# EAGLE design Group G (EAGLE 9.6.2)
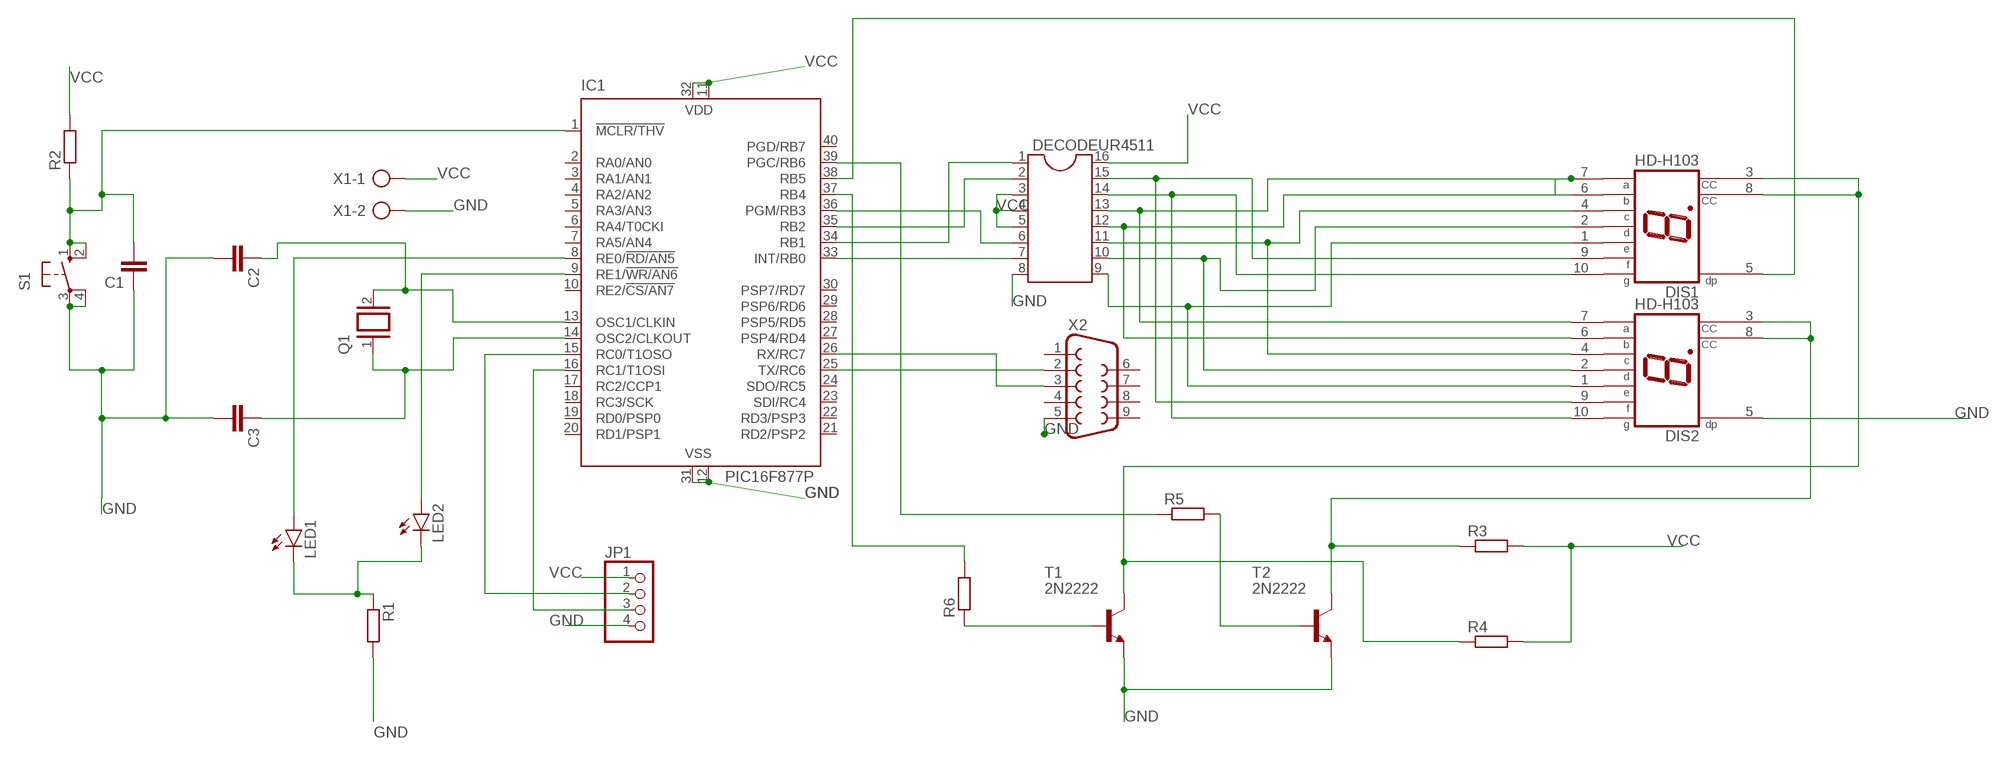
[diagram p0: schematic, sheet 1]

## Parts
C1  C-EU025-025X050  [C025-025X050]
C2  C-EU025-025X050  [C025-025X050]
C3  C-EU025-025X050  [C025-025X050]
DECODEUR4511  DIL16  [DIL16]
DIS1  HD-H103  [HDSP-M]
DIS2  HD-H103  [HDSP-M]
IC1  PIC16F877P  [DIL40]
JP1  PINHD-1X4  [1X04]
LED1  LED5MM  [LED5MM]
LED2  LED5MM  [LED5MM]
Q1  XTAL/S  [QS]
R1  R-EU_0207/10  [0207/10]
R2  R-EU_0207/10  [0207/10]
R3  R-EU_0207/10  [0207/10]
R4  R-EU_0207/10  [0207/10]
R5  R-EU_0207/10  [0207/10]
R6  R-EU_0207/10  [0207/10]
S1  10-XX  [B3F-10XX]
T1  2N2222  [TO18]
T2  2N2222  [TO18]
X1  AK300/2  [AK300/2]
X2  F09H  [F09H]

## Nets
GND: C1.1 C2.2 C3.2 DECODEUR4511.8 DIS2.5(DP) IC1.12(VSS) IC1.31(VSS) JP1.4 R1.2 S1.3(P) S1.4(P1) T1.1(E) T2.1(E) X1.2 X2.5
N$1: IC1.25(TX/RC6) X2.2
N$2: IC1.26(RX/RC7) X2.3
N$3: DECODEUR4511.7 IC1.33(INT/RB0)
N$4: DECODEUR4511.1 IC1.34(RB1)
N$5: DECODEUR4511.2 IC1.35(RB2)
N$6: DECODEUR4511.6 IC1.36(PGM/RB3)
N$7: DECODEUR4511.13 DIS1.7(A) DIS2.7(A)
N$8: DECODEUR4511.15 DIS1.9(F) DIS2.9(F)
N$9: DECODEUR4511.14 DIS1.10(G) DIS2.10(G)
N$10: DECODEUR4511.10 DIS1.2(D) DIS2.2(D)
N$11: DECODEUR4511.12 DIS1.6(B) DIS2.6(B)
N$12: DECODEUR4511.11 DIS1.4(C) DIS2.4(C)
N$13: DECODEUR4511.9 DIS1.1(E) DIS2.1(E)
N$14: IC1.8(RE0/!RD/AN5) LED1.A
N$15: IC1.37(RB4) R6.2
N$16: R6.1 T1.2(B)
N$17: IC1.15(RC0/T1OSO) JP1.2
N$18: DIS1.5(DP) IC1.38(RB5)
N$19: IC1.39(PGC/RB6) R5.1
N$20: R5.2 T2.2(B)
N$23: IC1.9(RE1/!WR/AN6) LED2.A
N$26: C1.2 IC1.1(!MCLR/THV) R2.1 S1.1(S) S1.2(S1)
N$27: IC1.16(RC1/T1OSI) JP1.3
N$30: C2.1 IC1.13(OSC1/CLKIN) Q1.2
N$31: C3.1 IC1.14(OSC2/CLKOUT) Q1.1
N$32: DIS1.3(CC) DIS1.8(CC) R4.1 T1.3(C)
N$35: DIS2.3(CC) DIS2.8(CC) R3.1 T2.3(C)
N$36: LED1.K(C) LED2.K(C) R1.1
VCC: DECODEUR4511.3 DECODEUR4511.4 DECODEUR4511.5 DECODEUR4511.16 IC1.11(VDD) IC1.32(VDD) JP1.1 R2.2 R3.2 R4.2 X1.1
Unconnected: IC1.2(RA0/AN0) IC1.3(RA1/AN1) IC1.4(RA2/AN2) IC1.5(RA3/AN3) IC1.6(RA4/T0CKI) IC1.7(RA5/AN4) IC1.10(RE2/!CS/AN7) IC1.17(RC2/CCP1) IC1.18(RC3/SCK) IC1.19(RD0/PSP0) IC1.20(RD1/PSP1) IC1.21(RD2/PSP2) IC1.22(RD3/PSP3) IC1.23(SDI/RC4) IC1.24(SDO/RC5) IC1.27(PSP4/RD4) IC1.28(PSP5/RD5) IC1.29(PSP6/RD6) IC1.30(PSP7/RD7) IC1.40(PGD/RB7) X2.1 X2.4 X2.6 X2.7 X2.8 X2.9

## Library data of the parts
C1-C3 = rcl:C-EU: CAPACITOR, European symbol; SPICEPREFIX: C
DECODEUR4511 = ic-package:DIL16: Dual In Line / Socket
DIS1 DIS2 = display-hp:HD-H103: LED DISPLAY 1-character 7 segment, decimal point right; OC_FARNELL: unknown; OC_NEWARK: unknown
IC1 = microchip:PIC16F87*: MICROCONTROLLER; MF: MICROCHIP; MPN: PIC16F877-04/P; OC_FARNELL: 9761349; OC_NEWARK: 61K3463
JP1 = pinhead:PINHD-1X4: PIN HEADER
LED1 LED2 = led:LED: LED OSRAM: - CHIPLED LG R971, LG N971, LY N971, LG Q971, LY Q971, LO R971, LY R971 LH N974, LH R974 LS Q976, LO Q976, LY Q976 LO Q996 - Hyper CHIPLED LW Q18S LB Q993, LB Q99A, LB R99A - SideLED LS A670, LO A670, LY A670, LG A670, LP A670 LB A673, LV A673, LT A673, LW A673 LH A674 LY A675 LS A676, LA A676, LO A676, LY A676, LW A676 LS A679, LY A679, LG A679 - Hyper Micro SIDELED® LS Y876, LA Y876, LO Y876, LY Y876 LT Y87S - SmartLED LW L88C, LW L88S LB L89C, LB L89S, LG L890 LS L89K, LO L89K, LY L89K LS L896, LA L896, LO L896, LY L896 - TOPLED LS T670, LO T670, LY T670, LG T670, LP T670 LSG T670, LSP T670, LSY T670, LOP T670, LYG T670 LG T671, LOG T671, LSG T671 LB T673, LV T673, LT T673, LW T673 LH T674 LS T676, LA T676, LO T676, LY T676, LB T676, LH T676, LSB T676, LW T676 LB T67C, LV T67C, LT T67C, LS T67K, LO T67K, LY T67K, LW E67C LS E67B, LA E67B, LO E67B, LY E67B, LB E67C, LV E67C, LT E67C LW T67C LS T679, LY T679, LG T679 LS T770, LO T770, LY T770, LG T770, LP T770 LB T773, LV T773, LT T773, LW T773 LH T774 LS E675, LA E675, LY E675, LS T675 LS T776, LA T776, LO T776, LY T776, LB T776 LHGB T686 LT T68C, LB T68C - Hyper Mini TOPLED® LB M676 - Mini TOPLED Santana® LG M470 LS M47K, LO M47K, LY M47K Source: http://www.osram.convergy.de LUXEON: - LUMILED® LXK2-PW12-R00, LXK2-PW12-S00, LXK2-PW14-U00, LXK2-PW14-V00 LXK2-PM12-R00, LXK2-PM12-S00, LXK2-PM14-U00 LXK2-PE12-Q00, LXK2-PE12-R00, LXK2-PE12-S00, LXK2-PE14-T00, LXK2-PE14-U00 LXK2-PB12-K00, LXK2-PB12-L00, LXK2-PB12-M00, LXK2-PB14-N00, LXK2-PB14-P00, LXK2-PB14-Q00 LXK2-PR12-L00, LXK2-PR12-M00, LXK2-PR14-Q00, LXK2-PR14-R00 LXK2-PD12-Q00, LXK2-PD12-R00, LXK2-PD12-S00 LXK2-PH12-R00, LXK2-PH12-S00 LXK2-PL12-P00, LXK2-PL12-Q00, LXK2-PL12-R00 Source: www.luxeon.com KINGBRIGHT: KA-3528ASYC Source: www.kingbright.com
Q1 = special:XTAL/S: CRYSTAL
R1-R6 = rcl:R-EU_: RESISTOR, European symbol; SPICEPREFIX: R
S1 = switch-omron:10-XX: OMRON SWITCH; MPN: B3F-1000; OC_FARNELL: 176432; OC_NEWARK: 36M3542
T1 T2 = transistor-neu-to92:2N2222: NPN TRANSISTOR
X1 = con-ptr500:AK300/2: CONNECTOR; OC_FARNELL: unknown; OC_NEWARK: unknown
X2 = con-subd:F09: SUB-D; OC_FARNELL: unknown; OC_NEWARK: unknown

## Board
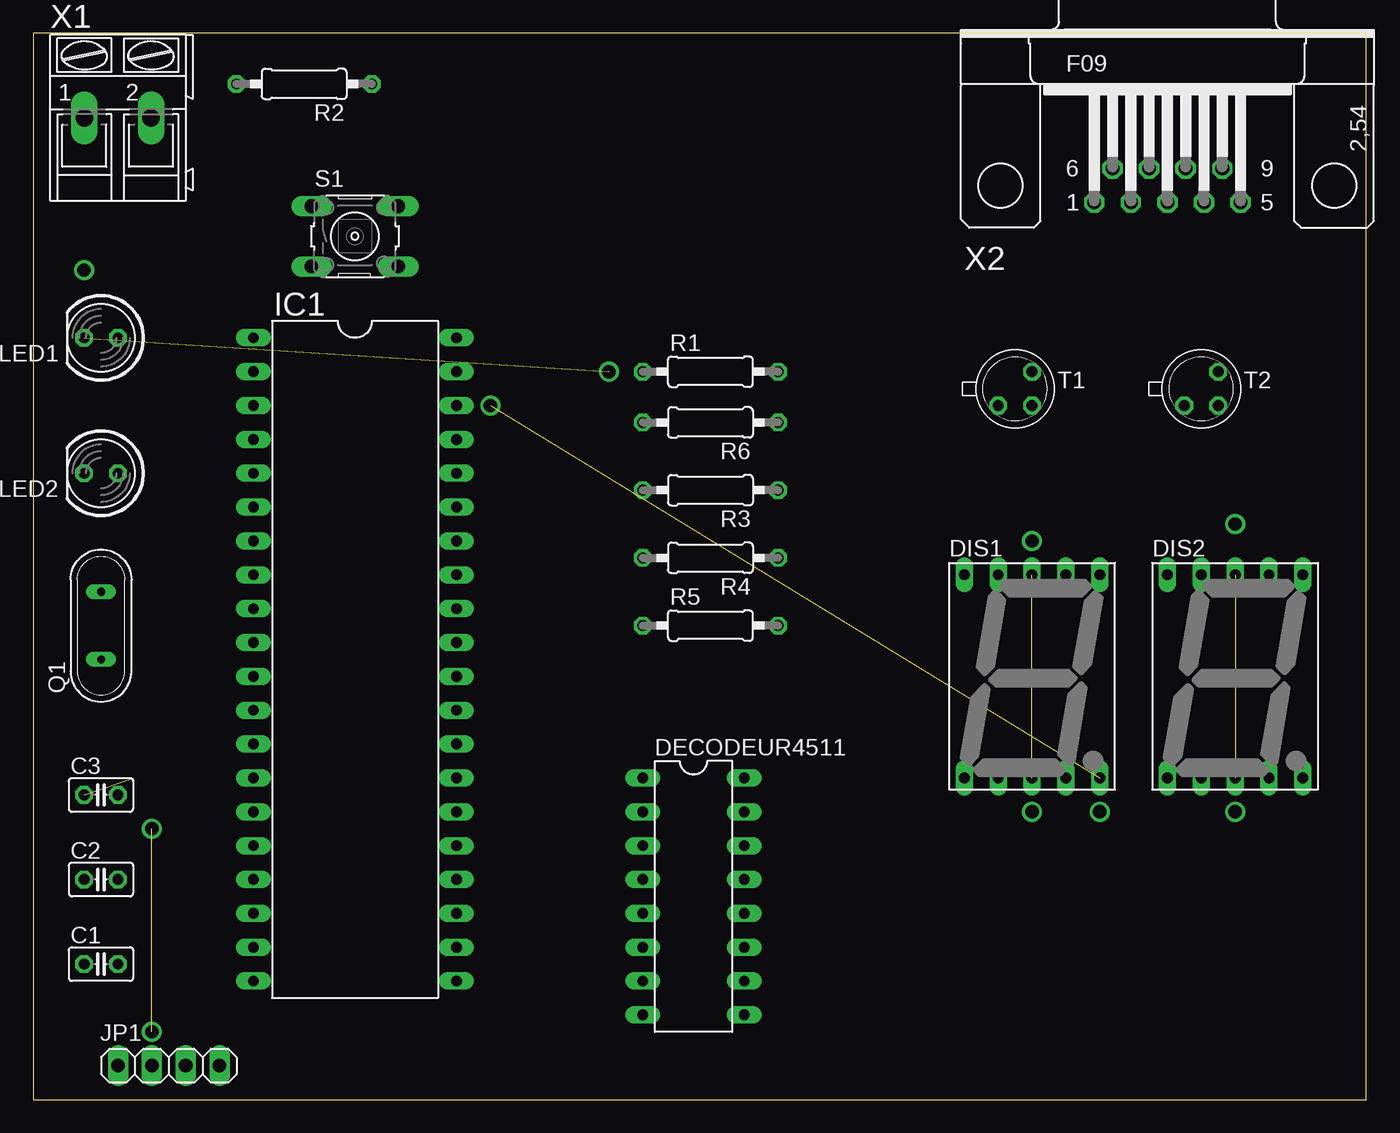
[diagram p1: board, top side]
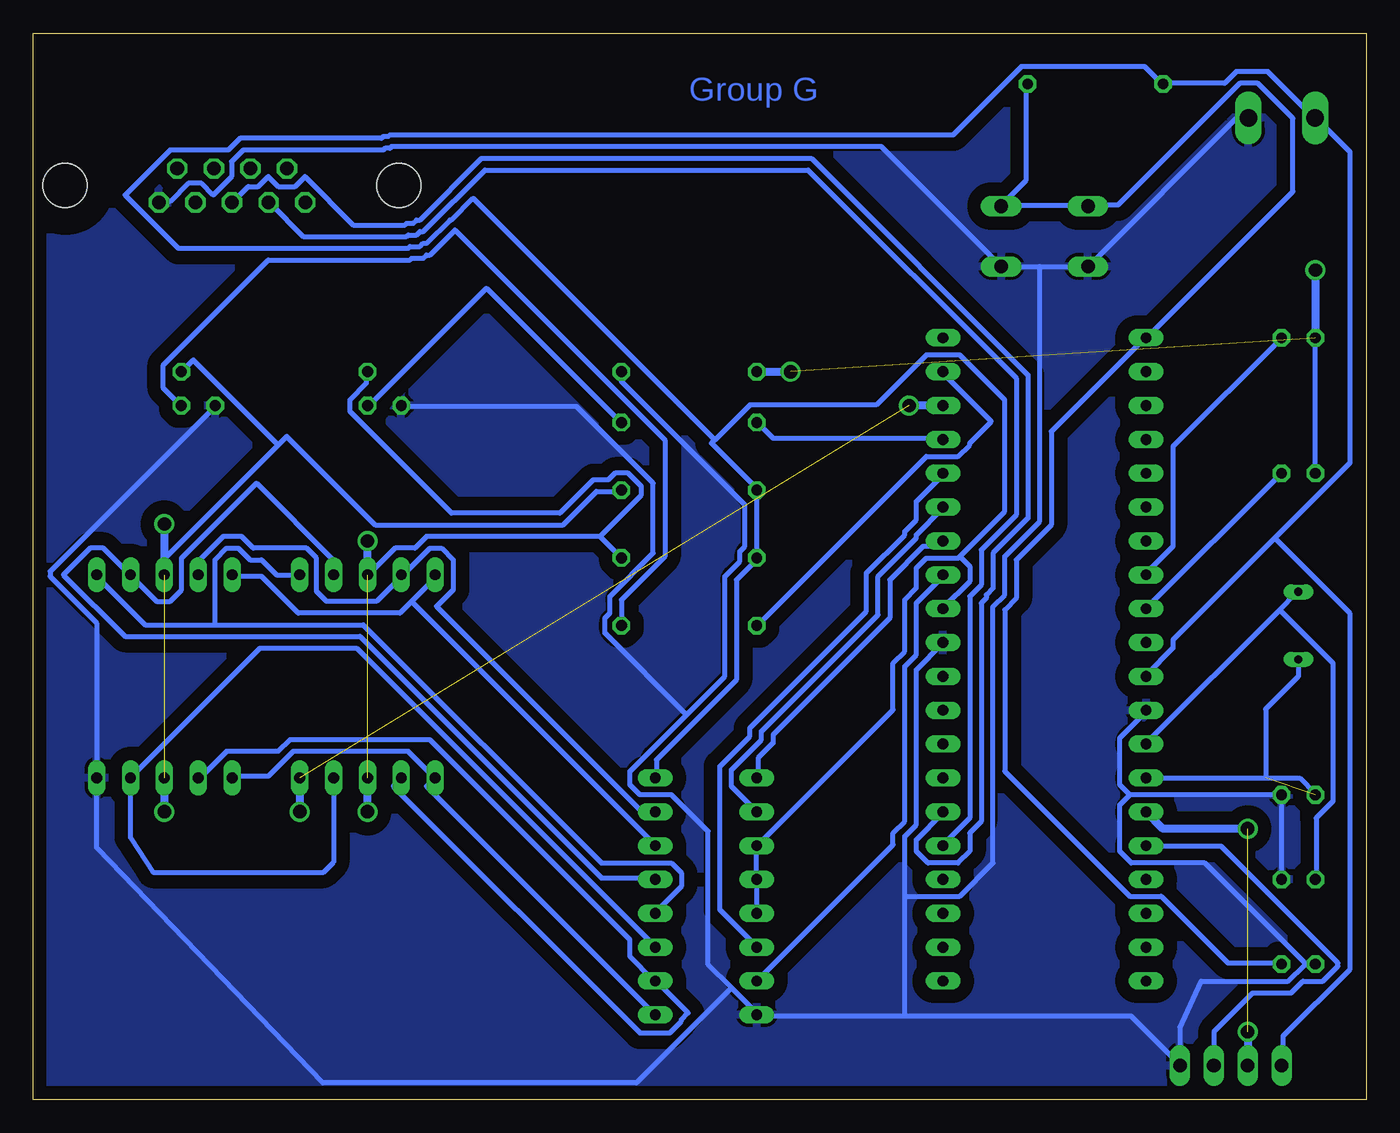
[diagram p2: board, bottom side, seen from below]

Size 100 x 80 mm. Coordinates in mm from the lower left corner, seen from the top.
Outline: 0,0 100,0 100,80 0,80 0,0
Copper layers (1*16): Top 0.035mm / dielectric 1.5mm / Bottom 0.035mm
Design rules "default *": minimum track width 15mil, minimum drill 0.35mm, track to track 15mil, track to pad 15mil, pad to pad 15mil, via to via 15mil, smd to smd 15mil, copper to edge 40mil, drill to drill 6mil, minimum pad ring 10mil, minimum via ring 8mil, stop-mask expansion 4mil, vias tented up to drill 0mil, thermal gap 10mil

### Footprints (pad centres in the part's own frame; a part is rotated, then mirrored left to right if it is on the bottom)
C025-025X050 = drill 0.813 octagon: 1 -1.27,0; 2 1.27,0
DIL16 = drill 0.813 long: 1 -8.89,-3.81; 2 -6.35,-3.81; 3 -3.81,-3.81; 4 -1.27,-3.81; 5 1.27,-3.81; 6 3.81,-3.81; 7 6.35,-3.81; 8 8.89,-3.81; 9 8.89,3.81; 10 6.35,3.81; 11 3.81,3.81; 12 1.27,3.81; 13 -1.27,3.81; 14 -3.81,3.81; 15 -6.35,3.81; 16 -8.89,3.81
HDSP-M = drill 0.813 long: 1 -5.08,-7.62; 2 -2.54,-7.62; 3 0,-7.62; 4 2.54,-7.62; 5 5.08,-7.62; 6 5.08,7.62; 7 2.54,7.62; 8 0,7.62; 9 -2.54,7.62; 10 -5.08,7.62
DIL40 = drill 0.813 long: 1 -24.13,-7.62; 2 -21.59,-7.62; 3 -19.05,-7.62; 4 -16.51,-7.62; 5 -13.97,-7.62; 6 -11.43,-7.62; 7 -8.89,-7.62; 8 -6.35,-7.62; 9 -3.81,-7.62; 10 -1.27,-7.62; 11 1.27,-7.62; 12 3.81,-7.62; 13 6.35,-7.62; 14 8.89,-7.62; 15 11.43,-7.62; 16 13.97,-7.62; 17 16.51,-7.62; 18 19.05,-7.62; 19 21.59,-7.62; 20 24.13,-7.62; 21 24.13,7.62; 22 21.59,7.62; 23 19.05,7.62; 24 16.51,7.62; 25 13.97,7.62; 26 11.43,7.62; 27 8.89,7.62; 28 6.35,7.62; 29 3.81,7.62; 30 1.27,7.62; 31 -1.27,7.62; 32 -3.81,7.62; 33 -6.35,7.62; 34 -8.89,7.62; 35 -11.43,7.62; 36 -13.97,7.62; 37 -16.51,7.62; 38 -19.05,7.62; 39 -21.59,7.62; 40 -24.13,7.62
1X04 = drill 1.016 long: 1 -3.81,0; 2 -1.27,0; 3 1.27,0; 4 3.81,0
LED5MM = drill 0.813 octagon: A -1.27,0; K 1.27,0
QS = drill 0.61 long: 1 -2.54,0; 2 2.54,0
0207/10 = drill 0.813 octagon: 1 -5.08,0; 2 5.08,0
B3F-10XX = drill 1.016 long: 1 -3.251,2.261; 2 3.251,2.261; 3 -3.251,-2.261; 4 3.251,-2.261
TO18 = drill 0.813 octagon: 1 -1.27,-1.27; 2 1.27,-1.27; 3 1.27,1.27
AK300/2 = drill 1.321 long: 1 -2.515,0; 2 2.489,0
F09H = drill 1.016 octagon: 1 -5.486,-1.27; 2 -2.743,-1.27; 3 0,-1.27; 4 2.743,-1.27; 5 5.486,-1.27; 6 -4.115,1.27; 7 -1.372,1.27; 8 1.372,1.27; 9 4.115,1.27 | hole 3.302: -12.522,0; 12.522,0

### Placement (x,y rotation side)
C1  5.08,10.16 0 top
C2  5.08,16.51 0 top
C3  5.08,22.86 0 top
DECODEUR4511  49.53,15.24 270 top
DIS1  74.93,31.75 0 top
DIS2  90.17,31.75 0 top
IC1  24.13,33.02 270 top
JP1  10.16,2.54 0 top
LED1  5.08,57.15 180 top
LED2  5.08,46.99 180 top
Q1  5.08,35.56 90 top
R1  50.8,54.61 0 top
R2  20.32,76.2 180 top
R3  50.8,45.72 180 top
R4  50.8,40.64 180 top
R5  50.8,35.56 0 top
R6  50.8,50.8 180 top
S1  24.13,64.77 0 top
T1  73.66,53.34 0 top
T2  87.63,53.34 0 top
X1  6.35,73.66 0 top
X2  85.09,68.58 0 top

### Tracks (layer width: path | path; a pad name or v marks a point on that pad's centre or on a via)
GND
  Bottom 0.381: 24.5,62.5 S1.4 27.5,62.62 36.38,71.5 73.12,71.5 73.25,71.38 73.62,71.38 73.75,71.25 84.25,71.25 85.12,70.38 85.12,69.25 86.5,67.88 87.38,68.75 88.38,68.75 89.75,67.38 90.5,67.38 X2.5 | 24.5,62.5 21,62.5 S1.3 20.75,62.62 9.75,73.62 8.88,73.62 X1.2 | T2.1 86.38,52 98.75,39.62 98.75,39.25 95.25,35.75 DIS2.5 95.25,18.9 78.28,1.25 54.75,1.25 47.62,8.38 | C2.2 6.38,16.62 6.38,22.75 C3.2 6.5,22.88 17.75,22.88 | 17.75,22.88 18.5,23.62 18.5,27.12 16.62,29 16.62,29.12 IC1.12 | 34.62,6.25 17.62,6.25 14,2.62 JP1.4 13.97,5.35 12.37,8.88 5.88,8.88 4.62,10.12 | 34.62,6.25 45.62,6.25 DECODEUR4511.8 45.75,6.5 47.62,8.38 | 4.62,10.12 3.88,10.12 C1.1 | 34.62,6.25 34.62,15.25 | 34.62,15.25 34.62,19.75 33.75,20.62 33.75,32.25 31.75,34.25 IC1.31 | 51,28.88 55.25,24.62 55.25,23.62 54.5,22.88 52.12,22.88 49.38,20.12 49.38,10.12 47.62,8.38 | 51,28.88 48.12,31.75 48.12,39.25 47,40.38 47,41.12 46.62,41.5 46.62,44.62 55.88,53.88 55.88,54.5 R1.2 | 51,28.88 57.12,35 57.12,36.12 56.75,36.5 56.75,37.75 53.5,41 53.5,46.25 59.25,52 72.38,52 T1.1 | 17.75,22.88 18.5,22.12 18.5,18.62 17.62,17.75 12.12,17.75 4.62,10.25 4.62,10.12 | 24.5,62.5 24.5,43.38 27.12,40.75 27.12,37.88 28,37 28,17.75 30.5,15.25 34.62,15.25
  pour Bottom (isolate 1.016): 0,80.01 100.33,80.01 100.33,0 0,0
N$1
  Bottom 0.381: IC1.25 31.75,19.12 29.75,21.12 29.75,37.75 28.88,38.62 28.88,41.25 26.25,43.88 26.25,54.12 41.88,69.75 66.12,69.75 70.75,65.12 71,65.12 71.25,64.88 71.88,64.88 72,64.75 79.75,64.75 82.25,67.25 X2.2
N$2
  Bottom 0.381: IC1.26 31.75,21.5 33.75,19.5 33.75,18.62 32.88,17.75 30.62,17.75 29.75,18.62 29.75,20 28.88,20.88 28.88,37.25 28.5,37.62 28.5,37.88 28,38.38 28,41 25.38,43.62 25.38,54.38 41.62,70.62 66.38,70.62 71,66 71.25,66 71.5,65.75 72,65.75 72.12,65.62 76,65.62 79.62,69.25 80.38,68.5 81.62,68.5 82.38,69.25 83.12,68.5 83.88,68.5 85,67.38 X2.3
N$3
  Bottom 0.381: IC1.33 31.75,39.25 33.75,37.25 33.75,33.38 34.62,32.5 34.62,20.88 35.5,20 35.5,19.12 45.62,9 DECODEUR4511.7
N$4
  Bottom 0.381: DECODEUR4511.1 45.62,24.25 45.62,25.62 44.5,26.75 44.5,27.38 35.75,36.12 35.75,39 33.25,41.5 32.12,41.5 31.75,41.88 IC1.34
N$5
  Bottom 0.381: IC1.35 31.75,44.38 33.75,42.38 33.75,42.12 36.62,39.25 36.62,36.38 45.38,27.62 45.38,27 47.62,24.75 47.62,23.5 45.75,21.62 DECODEUR4511.2
N$6
  Bottom 0.381: IC1.36 31.75,46.88 33.75,44.88 33.75,43.5 34.62,42.62 34.62,42.38 37.5,39.5 37.5,36.62 46.25,27.88 46.25,27.25 48.5,25 48.5,14.25 45.75,11.5 DECODEUR4511.6
N$7
  Bottom 0.381: DECODEUR4511.13 53.38,16.62 57.38,16.62 75.5,34.75 93.12,34.75 97.75,39.38 95.75,41.38 94.75,41.38 92.75,39.38 DIS2.7 92.62,39.25 90.75,37.38 89.75,37.38 88.88,38.25 88.88,40.62 83.25,46.25 77.5,40.5 77.5,39.38 DIS1.7
N$8
  Bottom 0.381: DECODEUR4511.15 53.38,21.62 54.38,21.62 69.75,37 68.5,38.25 68.5,40.5 69.38,41.38 70.25,41.38 72.38,39.25 DIS1.9 72.5,39.12 74.25,37.38 78,37.38 78.75,38.12 78.75,40.62 79.5,41.38 83.5,41.38 84.38,42.25 85.75,42.25 87.62,40.38 DIS2.9
N$9
  Bottom 0.381: 71.62,37.38 53.38,19.12 DECODEUR4511.14 | 71.62,37.38 69.75,39.25 DIS1.10 | 71.62,37.38 72.5,36.5 80.12,36.5 82.88,39.25 85,39.25 DIS2.10
N$10
  Bottom 0.381: DIS1.2 72.38,24.12 73,23.5 54.5,5 52.25,5 51.38,5.88 51.38,6 50.88,6.5 53.25,8.88 DECODEUR4511.10 53.5,9 55.25,10.75 55.25,12 70.25,27 80.75,27 81.62,26.12 85.5,26.12 87.38,24.25 87.62,24.25 DIS2.2
N$11
  Bottom 0.381: 86.38,35.62 91.62,35.62 95.25,39.25 DIS2.6 | 86.38,35.62 75.25,35.62 57.38,17.75 52.12,17.75 51.38,17 51.38,16 53.25,14.12 53.25,14 DECODEUR4511.12 | 86.38,35.62 86.38,40.5 85.5,41.38 84.62,41.38 83.75,40.5 82.88,40.5 81.75,39.38 80.12,39.38 DIS1.6
N$12
  Bottom 0.381: DECODEUR4511.11 53.38,11.5 75.75,33.88 83,33.88 92.62,24.25 DIS2.4 92.71,19.65 91.01,17.05 78.23,17.05 77.47,17.8 DIS1.4
N$13
  Bottom 0.381: DECODEUR4511.9 53.38,6.38 70.5,23.5 69.88,24.12 DIS1.1 70,24.25 71.88,26.12 80.5,26.12 82.38,24.25 85,24.25 DIS2.1
N$14
  Bottom 0.381: LED1.A 14.5,49 14.5,41.5 16.5,39.5 IC1.8
N$15
  Bottom 0.381: IC1.37 31.75,49.62 44.5,49.62 45.62,50.75 R6.2
N$16
  Bottom 0.381: R6.1 56,50.88 66,60.88 74.88,52 T1.2
N$17  (via drill 1 pad 1.3)  (1 unrouted)
  Bottom 0.61: v8.89,5.08 JP1.2 | v8.89,20.32 15.24,20.32 IC1.15
N$18  (via drill 1 pad 1.3)  (1 unrouted)
  Bottom 0.61: IC1.38 v34.29,52.07 | DIS1.5 v80.01,21.59
N$19
  Bottom 0.381: IC1.39 31.75,54.5 28.12,50.88 29.75,49.25 29.75,49.12 30.62,48.25 33,48.25 45.62,35.62 R5.1
N$20
  Bottom 0.381: R5.2 55.88,35.62 55.88,37.5 52.62,40.75 52.62,49.5 68.38,65.25 70.25,63.38 70.5,63.38 70.75,63.12 71.62,63.12 71.75,63 82.38,63 90.25,55.12 90.25,53.38 89,52.12 T2.2
N$23
  Bottom 0.381: LED2.A 6.38,46.88 6.5,46.88 16.5,36.88 IC1.9
N$26
  Bottom 0.381: R2.1 25.5,76.12 25.5,69 27.38,67.12 S1.2 27.12,67.12 21,67.12 S1.1 20.75,67.12 18.62,67.12 9.5,76.25 8.12,76.25 5.5,73.62 5.5,68.12 16.38,57.25 IC1.1 16.62,57.12 23.62,50.12 23.62,43.12 26.25,40.5 26.25,37.62 27.12,36.75 27.12,24.62 17.75,15.25 15.38,15.25 10.38,10.25 6.38,10.25 C1.2
N$27
  Bottom 0.381: IC1.16 16.5,19 10.88,19 2.12,10.25 2.12,10 3.25,8.88 4.75,8.88 5.62,8 8.51,8 11.43,5.08 JP1.3
N$30
  Bottom 0.381: 6.5,36.75 16.5,26.75 IC1.13 | 6.5,36.75 5.25,38 5.12,38 Q1.2 | 6.5,36.75 2.5,32.75 2.5,22.38 3.75,21.12 3.75,16.62 C2.1
N$31  (1 unrouted)
  Bottom 0.381: Q1.1 5.08,31.75 7.54,29.29 7.54,24.12 | C3.1 3.81,22.93 5,24.12 IC1.14
N$32  (via drill 1 pad 1.3)  (1 unrouted)
  Bottom 0.381: 57.5,42.25 70.5,42.25 71.38,41.38 72.88,41.38 74.88,39.38 DIS1.8 | 57.5,42.25 56,40.75 R4.1 | 57.5,42.25 54.38,45.38 54.38,46 55.38,47 56.38,47 56.88,46.5 58,46.5 60.5,44 68.62,44 76.25,51.62 76.25,52.5 75,53.75 75,54.5 T1.3
  Bottom 0.61: v74.93,21.59 DIS1.3 | DIS1.8 v74.93,41.91
N$35  (via drill 1 pad 1.3)  (1 unrouted)
  Bottom 0.381: 81.62,49.12 88,55.5 88.88,54.62 T2.3 | R3.1 56,45.62 57.75,45.62 60.25,43.12 74.36,43.12 80.99,49.76 81.62,49.12 | 81.62,49.12 90.12,40.62 90.12,39.38 DIS2.8
  Bottom 0.61: v90.17,43.18 DIS2.8 | DIS2.3 v90.17,21.59
N$36  (via drill 1 pad 1.3)  (1 unrouted)
  Bottom 0.381: LED2.K 3.88,47 3.88,57.12 LED1.K
  Bottom 0.61: v3.81,62.23 LED1.K | R1.1 v43.18,54.61
VCC
  Bottom 0.381: DECODEUR4511.16 53.25,24.25 53.25,25.5 47.25,31.5 47.25,39 45.75,40.5 R4.2 45.75,40.75 45.75,45.62 R3.2 45.75,45.88 49.12,49.25 48.88,49.5 | DECODEUR4511.5 45.75,14 45.75,16.5 DECODEUR4511.4 45.75,16.62 45.75,19 DECODEUR4511.3 45.62,19.12 35.5,29.25 35.5,32.75 34.62,33.62 34.62,37.5 33.75,38.38 33.75,39.88 33,40.62 30.62,40.62 30.5,40.75 | 30.5,40.75 29.75,40 29.75,38.88 31.75,36.88 IC1.32 | 48.88,49.5 46.25,52.12 36.75,52.12 33,55.88 30.5,55.88 27.12,52.5 27.12,44.12 30.5,40.75 | 6.88,42.12 1.23,47.77 1.23,71.11 3.75,73.62 X1.1 4,73.75 7.38,77.12 9.75,77.12 10.62,76.25 15.12,76.25 R2.2 15.38,76.25 16.62,77.5 25.88,77.5 31,72.38 73.25,72.38 73.38,72.25 73.75,72.25 73.88,72.12 84.5,72.12 85.38,71.25 89.75,71.25 93.12,67.88 89.12,63.88 71.88,63.88 71.75,64 71,64 70.75,64.25 70.5,64.25 68.75,66 68.62,66 67,67.62 48.88,49.5 | 6.88,42.12 14.5,34.5 14.5,33.88 16.5,31.88 IC1.11 | 6.88,42.12 1.25,36.5 1.25,9.75 6.25,4.75 6.25,2.62 JP1.1

### Text on the board
Bottom: Group G